# Altium schematic sheet Схема_сборки_у_without_temp_borders.SchDoc
size 420 x 297 mm; Address1: Address1; Address2: Address2; Address3: Address3; Address4: Address4; DocumentNumber: АБВГ.123456.001 Э3; SheetNumber: 4; SheetTotal: 5; Scale: 1:1; DocumentType: Схема электрическая принципиальная; FirstReferrence: АБВГ.123456.001
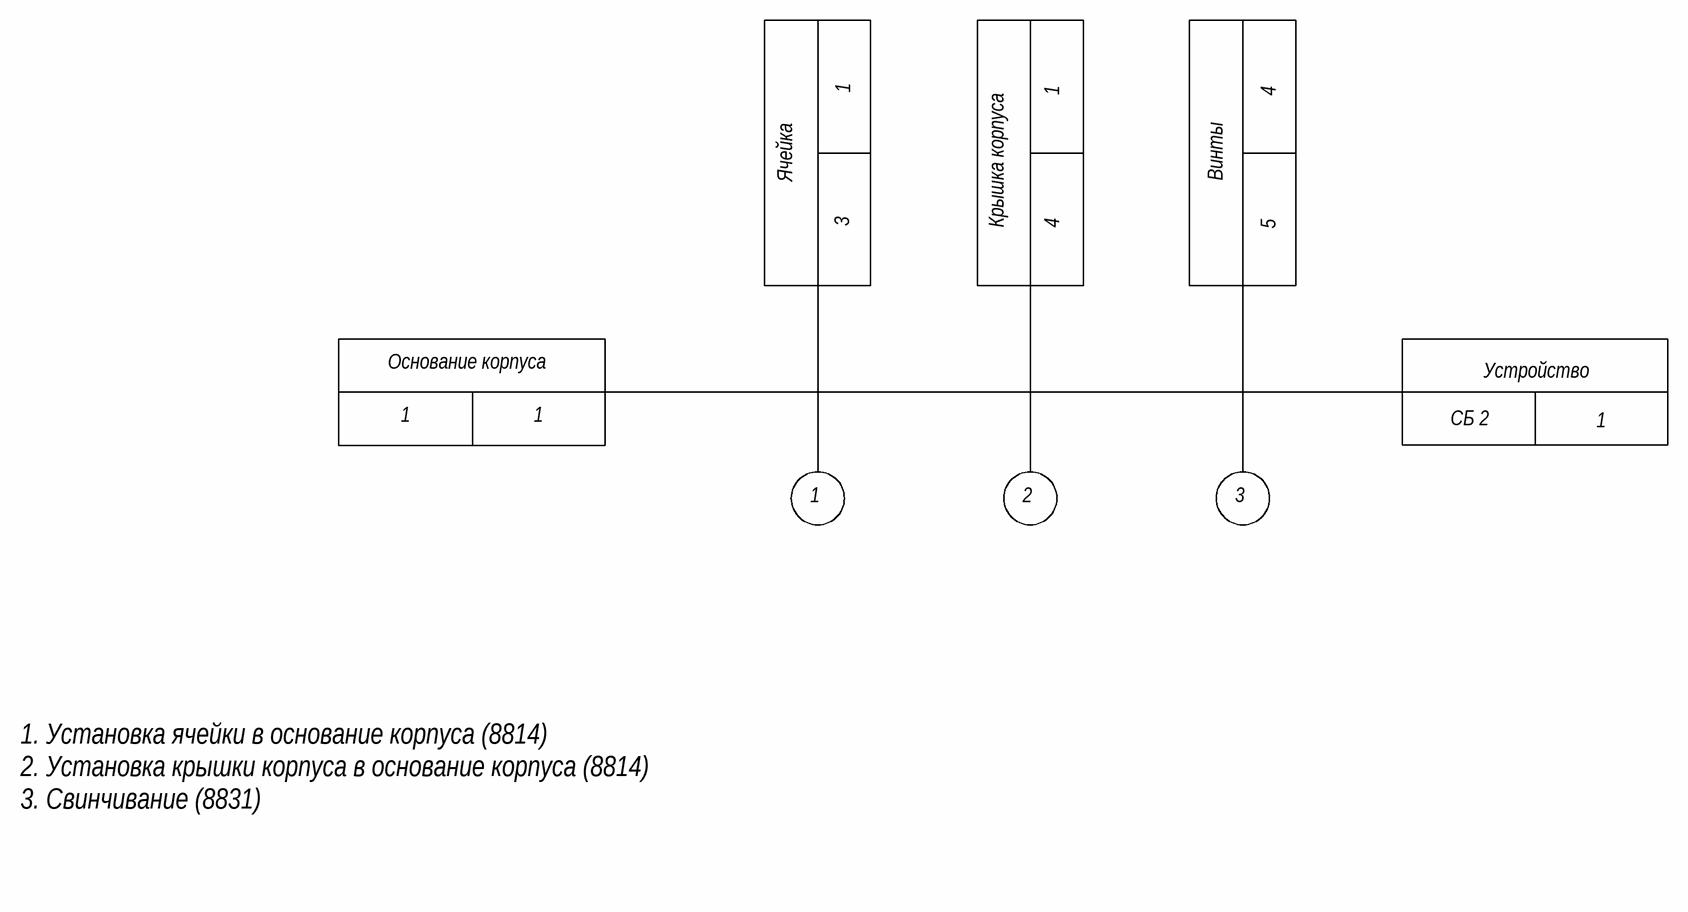
[diagram p0: Схема_сборки_у_without_temp_borders.SchDoc]

## Notes on the sheet
- 1
- 4
- Ячейка
- 3
- Крышка корпуса
- Винты
- 5
- Основание корпуса
- СБ 2
- Устройство
- 2
- 1. Установка ячейки в основание корпуса (8814)
  2. Установка крышки корпуса в основание корпуса (8814)
  3. Свинчивание (8831)